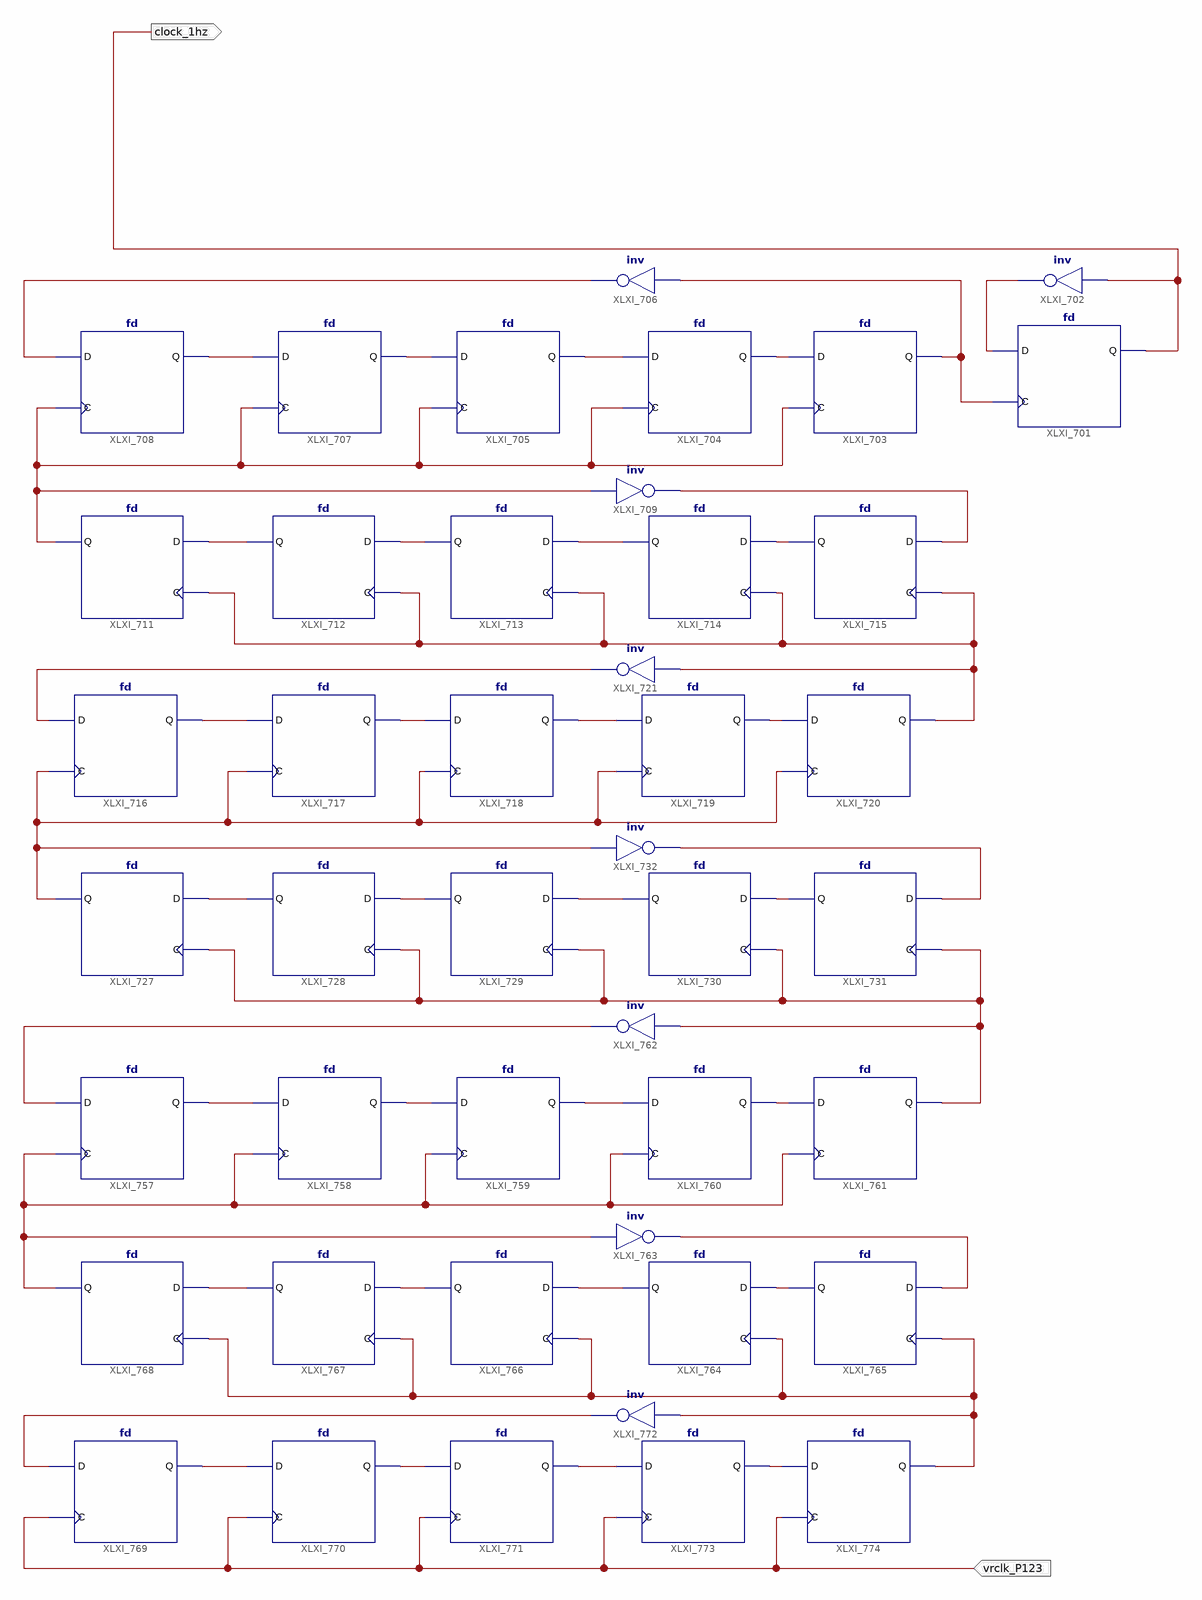
[diagram p0: schematic sheet 1]
// Xilinx ISE schematic counter0to9.sch (spartan6) as structural Verilog: 44 symbols, 2 ports
module counter0to9 (
  input  vrclk_P123,
  output clock_1hz
);

  wire XLXN_495, XLXN_496, XLXN_504, XLXN_505, XLXN_511, XLXN_512, XLXN_516, XLXN_517, XLXN_521, XLXN_522,
       XLXN_523, XLXN_524, XLXN_525, XLXN_526, XLXN_527, XLXN_528, XLXN_529, XLXN_530, XLXN_531, XLXN_539,
       XLXN_540, XLXN_541, XLXN_542, XLXN_543, XLXN_545, XLXN_554, XLXN_567, XLXN_568, XLXN_569, XLXN_570,
       XLXN_571, XLXN_572, XLXN_573, XLXN_574, XLXN_575, XLXN_576, XLXN_577, XLXN_578, XLXN_579, XLXN_580,
       XLXN_583, XLXN_588, XLXN_589;

  not XLXI_702 (XLXN_495, clock_1hz);
  fd XLXI_701 (.C(XLXN_496), .D(XLXN_495), .Q(clock_1hz));
  fd XLXI_703 (.C(XLXN_512), .D(XLXN_504), .Q(XLXN_496));
  not XLXI_706 (XLXN_517, XLXN_496);
  fd XLXI_704 (.C(XLXN_512), .D(XLXN_505), .Q(XLXN_504));
  fd XLXI_705 (.C(XLXN_512), .D(XLXN_511), .Q(XLXN_505));
  fd XLXI_707 (.C(XLXN_512), .D(XLXN_516), .Q(XLXN_511));
  fd XLXI_708 (.C(XLXN_512), .D(XLXN_517), .Q(XLXN_516));
  not XLXI_709 (XLXN_525, XLXN_512);
  fd XLXI_711 (.C(XLXN_526), .D(XLXN_521), .Q(XLXN_512));
  fd XLXI_712 (.C(XLXN_526), .D(XLXN_522), .Q(XLXN_521));
  fd XLXI_713 (.C(XLXN_526), .D(XLXN_523), .Q(XLXN_522));
  fd XLXI_714 (.C(XLXN_526), .D(XLXN_524), .Q(XLXN_523));
  fd XLXI_715 (.C(XLXN_526), .D(XLXN_525), .Q(XLXN_524));
  not XLXI_721 (XLXN_531, XLXN_526);
  fd XLXI_716 (.C(XLXN_539), .D(XLXN_531), .Q(XLXN_527));
  fd XLXI_717 (.C(XLXN_539), .D(XLXN_527), .Q(XLXN_528));
  fd XLXI_718 (.C(XLXN_539), .D(XLXN_528), .Q(XLXN_529));
  fd XLXI_719 (.C(XLXN_539), .D(XLXN_529), .Q(XLXN_530));
  fd XLXI_720 (.C(XLXN_539), .D(XLXN_530), .Q(XLXN_526));
  fd XLXI_727 (.C(XLXN_554), .D(XLXN_540), .Q(XLXN_539));
  fd XLXI_728 (.C(XLXN_554), .D(XLXN_541), .Q(XLXN_540));
  fd XLXI_731 (.C(XLXN_554), .D(XLXN_545), .Q(XLXN_543));
  not XLXI_732 (XLXN_545, XLXN_539);
  fd XLXI_730 (.C(XLXN_554), .D(XLXN_543), .Q(XLXN_542));
  fd XLXI_729 (.C(XLXN_554), .D(XLXN_542), .Q(XLXN_541));
  fd XLXI_757 (.C(XLXN_580), .D(XLXN_579), .Q(XLXN_568));
  fd XLXI_758 (.C(XLXN_580), .D(XLXN_568), .Q(XLXN_569));
  fd XLXI_759 (.C(XLXN_580), .D(XLXN_569), .Q(XLXN_567));
  fd XLXI_760 (.C(XLXN_580), .D(XLXN_567), .Q(XLXN_570));
  fd XLXI_761 (.C(XLXN_580), .D(XLXN_570), .Q(XLXN_554));
  not XLXI_762 (XLXN_579, XLXN_554);
  not XLXI_763 (XLXN_583, XLXN_580);
  fd XLXI_764 (.C(XLXN_588), .D(XLXN_571), .Q(XLXN_572));
  fd XLXI_765 (.C(XLXN_588), .D(XLXN_583), .Q(XLXN_571));
  fd XLXI_766 (.C(XLXN_588), .D(XLXN_572), .Q(XLXN_573));
  fd XLXI_767 (.C(XLXN_588), .D(XLXN_573), .Q(XLXN_574));
  fd XLXI_768 (.C(XLXN_588), .D(XLXN_574), .Q(XLXN_580));
  fd XLXI_769 (.C(vrclk_P123), .D(XLXN_589), .Q(XLXN_575));
  fd XLXI_770 (.C(vrclk_P123), .D(XLXN_575), .Q(XLXN_576));
  fd XLXI_771 (.C(vrclk_P123), .D(XLXN_576), .Q(XLXN_577));
  not XLXI_772 (XLXN_589, XLXN_588);
  fd XLXI_773 (.C(vrclk_P123), .D(XLXN_577), .Q(XLXN_578));
  fd XLXI_774 (.C(vrclk_P123), .D(XLXN_578), .Q(XLXN_588));
endmodule
